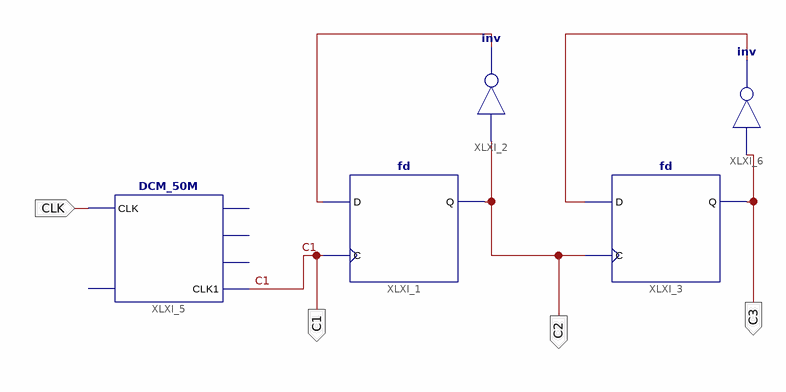
[diagram p0: schematic sheet 1]
// Xilinx ISE schematic Experiment1.sch (spartan3e) as structural Verilog: 5 symbols, 4 ports
module Experiment1 (
  input  CLK,
  output C1,
  output C2,
  output C3
);

  wire XLXN_2, XLXN_18;

  fd XLXI_1 (.C(C1), .D(XLXN_2), .Q(C2));
  not XLXI_2 (XLXN_2, C2);
  fd XLXI_3 (.C(C2), .D(XLXN_18), .Q(C3));
  DCM_50M XLXI_5 (.CLK(CLK), .CLK1(C1));  // open: RST, CLK1M, CLK10k, CLK1k
  not XLXI_6 (XLXN_18, C3);
endmodule
